# Altium schematic sheet RMP_MAIN.SchDoc
size Letter; SheetNumber: 1; SheetTotal: 7
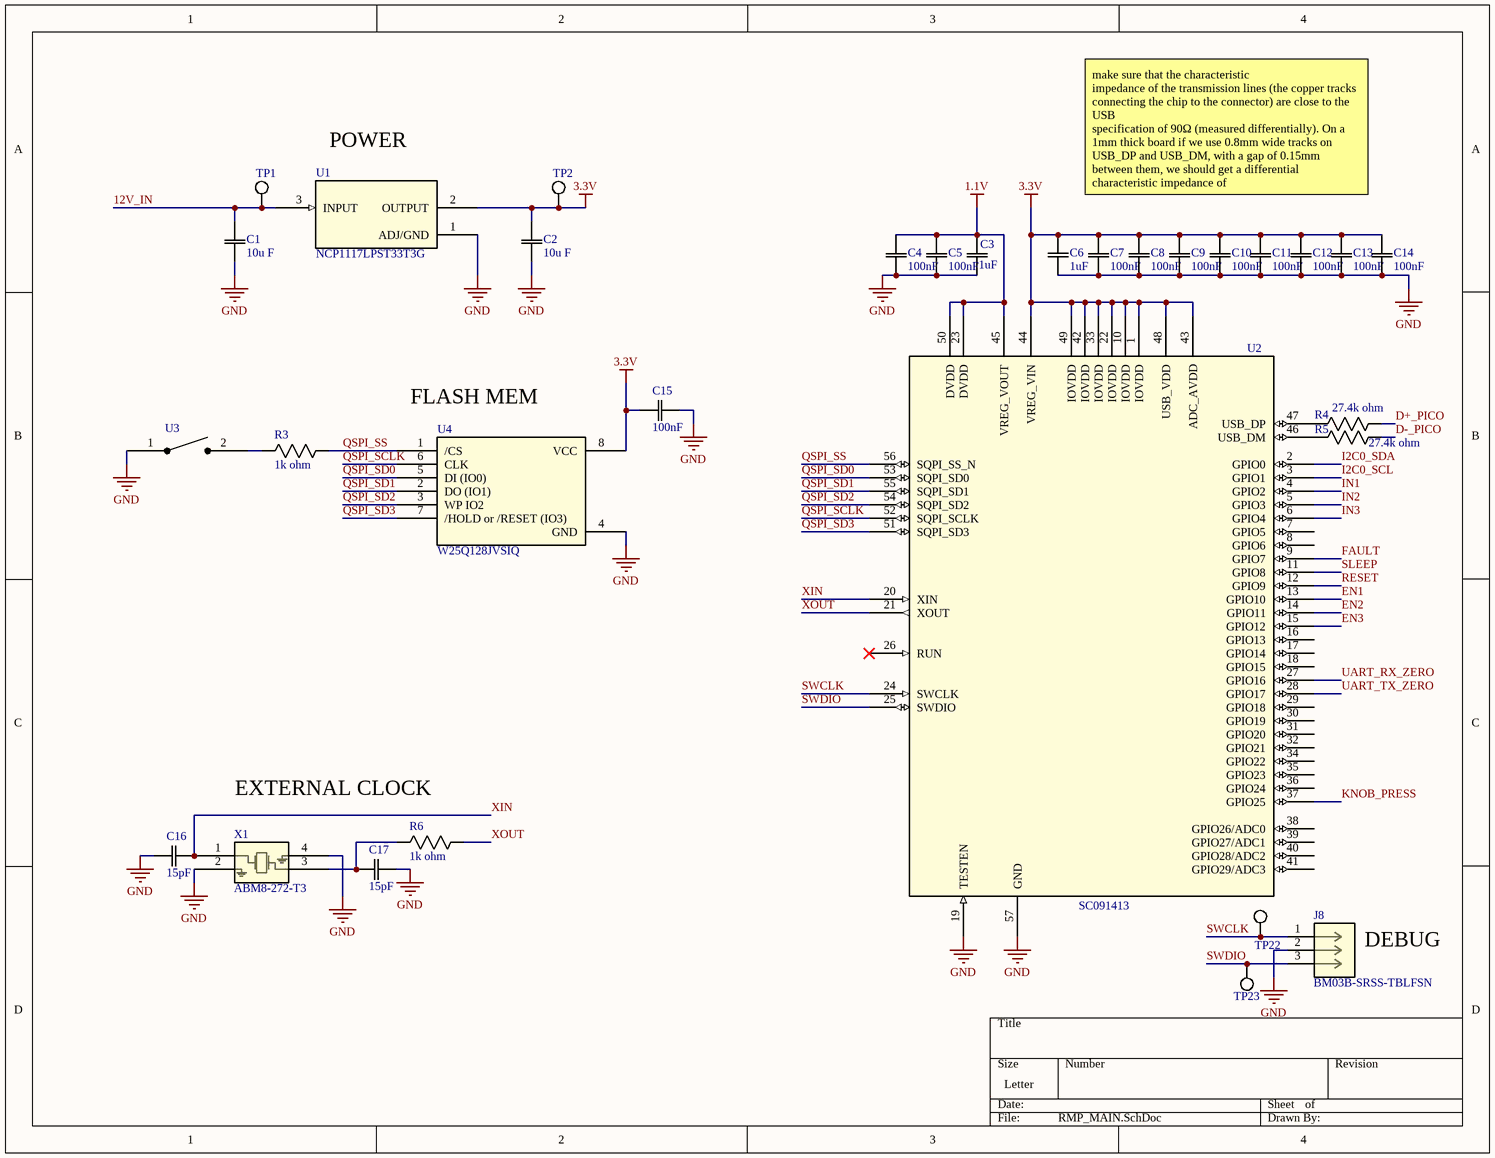
[diagram p0: RMP_MAIN.SchDoc]

## Parts
C1  value 10u F  [G-21_MUR-M]  (hidden comment: GRM21BR61C106KE15K)
C2  value 10u F  [G-21_MUR-M]  (hidden comment: GRM21BR61C106KE15K)
C3  value 1uF  [CAPC17595_90N_KEM-M]  (hidden comment: C0603C105K4RACTU)
C4  value 100nF  [CC0603N_YAG-M]  (hidden comment: CC0603KRX7R7BB104)
C5  value 100nF  [CC0603N_YAG-M]  (hidden comment: CC0603KRX7R7BB104)
C6  value 1uF  [CAPC17595_90N_KEM-M]  (hidden comment: C0603C105K4RACTU)
C7  value 100nF  [CC0603N_YAG-M]  (hidden comment: CC0603KRX7R7BB104)
C8  value 100nF  [CC0603N_YAG-M]  (hidden comment: CC0603KRX7R7BB104)
C9  value 100nF  [CC0603N_YAG-M]  (hidden comment: CC0603KRX7R7BB104)
C10  value 100nF  [CC0603N_YAG-M]  (hidden comment: CC0603KRX7R7BB104)
C11  value 100nF  [CC0603N_YAG-M]  (hidden comment: CC0603KRX7R7BB104)
C12  value 100nF  [CC0603N_YAG-M]  (hidden comment: CC0603KRX7R7BB104)
C13  value 100nF  [CC0603N_YAG-M]  (hidden comment: CC0603KRX7R7BB104)
C14  value 100nF  [CC0603N_YAG-M]  (hidden comment: CC0603KRX7R7BB104)
C15  value 100nF  [CC0603N_YAG-M]  (hidden comment: CC0603KRX7R7BB104)
C16  value 15pF  [CAP_CC0805_YAG-M]  (hidden comment: CC0805FRNPO9BN150)
C17  value 15pF  [CAP_CC0805_YAG-M]  (hidden comment: CC0805FRNPO9BN150)
J8  BM03B-SRSS-TBLFSN  [CONN_BM03B-SRSS-TBLFSN_JST]
R3  value 1k ohm  [RES_RNCF0805_STP-M]  (hidden comment: RNCF0805DTE1K00)
R4  value 27.4k ohm  [RESC1508X55N]  (hidden comment: MCT06030C2742FP500)
R5  value 27.4k ohm  [RESC1508X55N]  (hidden comment: MCT06030C2742FP500)
R6  value 1k ohm  [RES_RNCF0805_STP-M]  (hidden comment: RNCF0805DTE1K00)
TP1  TestPoint  [Testpoint]  (value not drawn)
TP2  TestPoint  [Testpoint]  (value not drawn)
TP22  TestPoint  [Testpoint]  (value not drawn)
TP23  TestPoint  [Testpoint]  (value not drawn)
U1  NCP1117LPST33T3G  [SOT223-3_ONS-M]
U2  SC091413  [QFN56_7X7_RPI-M]
U3  PTS636SM43SMTR LFS  [PTS636SM43SMTR LFS]  (value not drawn)
U4  W25Q128JVSIQ  [SOIC_128JVSIQ_WIN-M]
X1  ABM8-272-T3  [ABM8-272-T3_ABR]

## Nets
1.1V: C3.2 C4.2 C5.2 U2.23(DVDD) U2.45(VREG_VOUT) U2.50(DVDD)
3.3V: C2.2 C6.1 C7.2 C8.2 C9.2 C10.2 C11.2 C12.2 C13.2 C14.2 C15.2 TP2.1 U1.2(OUTPUT) U2.1(IOVDD) U2.10(IOVDD) U2.22(IOVDD) U2.33(IOVDD) U2.42(IOVDD) U2.43(ADC_AVDD) U2.44(VREG_VIN) U2.48(USB_VDD) U2.49(IOVDD) U4.8(VCC)
GND: C1.1 C2.1 C3.1 C4.1 C5.1 C6.2 C7.1 C8.1 C9.1 C10.1 C11.1 C12.1 C13.1 C14.1 C15.1 C16.1 C17.2 J8.2 U1.1(ADJ/GND) U2.19(TESTEN) U2.57(GND) U3.1 U4.4(GND) X1.2 X1.4
12V_IN: C1.2 TP1.1 U1.3(INPUT)
D+_PICO: R4.2
D-_PICO: R5.2
EN1: U2.13(GPIO10)
EN2: U2.14(GPIO11)
EN3: U2.15(GPIO12)
FAULT: U2.9(GPIO7)
I2C0_SCL: U2.3(GPIO1)
I2C0_SDA: U2.2(GPIO0)
IN1: U2.4(GPIO2)
IN2: U2.5(GPIO3)
IN3: U2.6(GPIO4)
KNOB_PRESS: U2.37(GPIO25)
QSPI_SCLK: U2.52(SQPI_SCLK) U4.6(CLK)
QSPI_SD0: U2.53(SQPI_SD0) U4.5(DI_(IO0))
QSPI_SD1: U2.55(SQPI_SD1) U4.2(DO_(IO1))
QSPI_SD2: U2.54(SQPI_SD2) U4.3(WP_IO2)
QSPI_SD3: U2.51(SQPI_SD3) U4.7(/HOLD_or_/RESET_(IO3))
QSPI_SS: R3.2 U2.56(SQPI_SS_N) U4.1(/CS)
RESET: U2.12(GPIO9)
SLEEP: U2.11(GPIO8)
SWCLK: J8.1 TP22.1 U2.24(SWCLK)
SWDIO: J8.3 TP23.1 U2.25(SWDIO)
UART_RX_ZERO: U2.27(GPIO16)
UART_TX_ZERO: U2.28(GPIO17)
XIN: C16.2 U2.20(XIN) X1.1
XOUT: R6.2 U2.21(XOUT)
NetC17_1: C17.1 R6.1 X1.3
NetR3_1: R3.1 U3.2
NetR4_1: R4.1 U2.47(USB_DP)
NetR5_1: R5.1 U2.46(USB_DM)

Not connected (* = marked no-connect by the designer): U2 7(GPIO5) 8(GPIO6) 16(GPIO13) 17(GPIO14) 18(GPIO15) 26(RUN)* 29(GPIO18) 30(GPIO19) 31(GPIO20) 32(GPIO21) 34(GPIO22) 35(GPIO23) 36(GPIO24) 38(GPIO26/ADC0) 39(GPIO27/ADC1) 40(GPIO28/ADC2) 41(GPIO29/ADC3)

## Notes on the sheet
- POWER
- make sure that the characteristic
  impedance of the transmission lines (the copper tracks connecting the chip to the connector) are close to the USB
  specification of 90Ω (measured differentially). On a 1mm thick board if we use 0.8mm wide tracks on
  USB_DP and USB_DM, with a gap of 0.15mm between them, we should get a differential characteristic impedance of
  around 90Ω
- (near U4) FLASH MEM
- EXTERNAL CLOCK
- (near J8) DEBUG

## Library data of the parts
C1 C2 = CAP_GRM21BR61C106KE15K: 10 µF ±10% 16V Ceramic Capacitor X5R 0805 (2012 Metric); Mfr_Name: Murata
C3 C6 = CAP_C0603C105K4RACTU: 1 µF ±10% 16V Ceramic Capacitor X7R 0603 (1608 Metric); Mfr_Name: Kemet
C4 C5 C7-C15 = CAP_CC0603KRX7R7BB104: 0.1 µF ±10% 16V Ceramic Capacitor X7R 0603 (1608 Metric); Mfr_Name: Yageo
C16 C17 = CAP_CC0805FRNPO9BN150: 15 pF ±1% 50V Ceramic Capacitor C0G, NP0 0805 (2012 Metric); Mfr_Name: Yageo
J8 = BM03B-SRSS-TBLFSN: No Description Available; Mfr_Name: JST; RefDes: RefDes; Type: Type
R3 R6 = RES_RNCF0805DTE1K00: 1 kOhms ±0.5% 0.25W, 1/4W Chip Resistor 0805 (2012 Metric) Automotive AEC-Q200 Thin Film; Mfr_Name: Stackpole International
R4 R5 = RES_MCT06030C2742FP500: 27.4 kOhms ±1% 0.125W, 1/8W Chip Resistor 0603 (1608 Metric) Anti-Sulfur Thin Film; Mfr_Name: Stackpole International
U1 = NCP1117LPST33T3G: Linear Voltage Regulator IC Positive Fixed 1 Output 1A SOT-223; Mfr_Name: onsemi; RefDes: RefDes; Type: Type
U2 = SC091413: ARM® Cortex®-M0+ - Microcontroller IC 32-Bit Dual-Core 133MHz External Program Memory 56-QFN (7x7); Mfr_Name: Raspberry Pi; Type: Embedded; RefDes: RefDes
U3 = PTS636SM43SMTR LFS: Tactile Switch SPST-NO Top Actuated Surface Mount
U4 = W25Q128JVSIQ: FLASH - NOR Memory IC 128Mbit SPI - Quad I/O, QPI 133 MHz 8-SOIC; Mfr_Name: Winbond; RefDes: RefDes; Type: Type
X1 = ABM8-272-T3: 12 MHz ±30ppm Crystal 10pF 50 Ohms 4-SMD, No Lead; Mfr_Name: Abracon; Type: Crystals; RefDes: RefDes